# EAGLE schematic Tri-color LED Breakout-v13 (EAGLE 6.3)
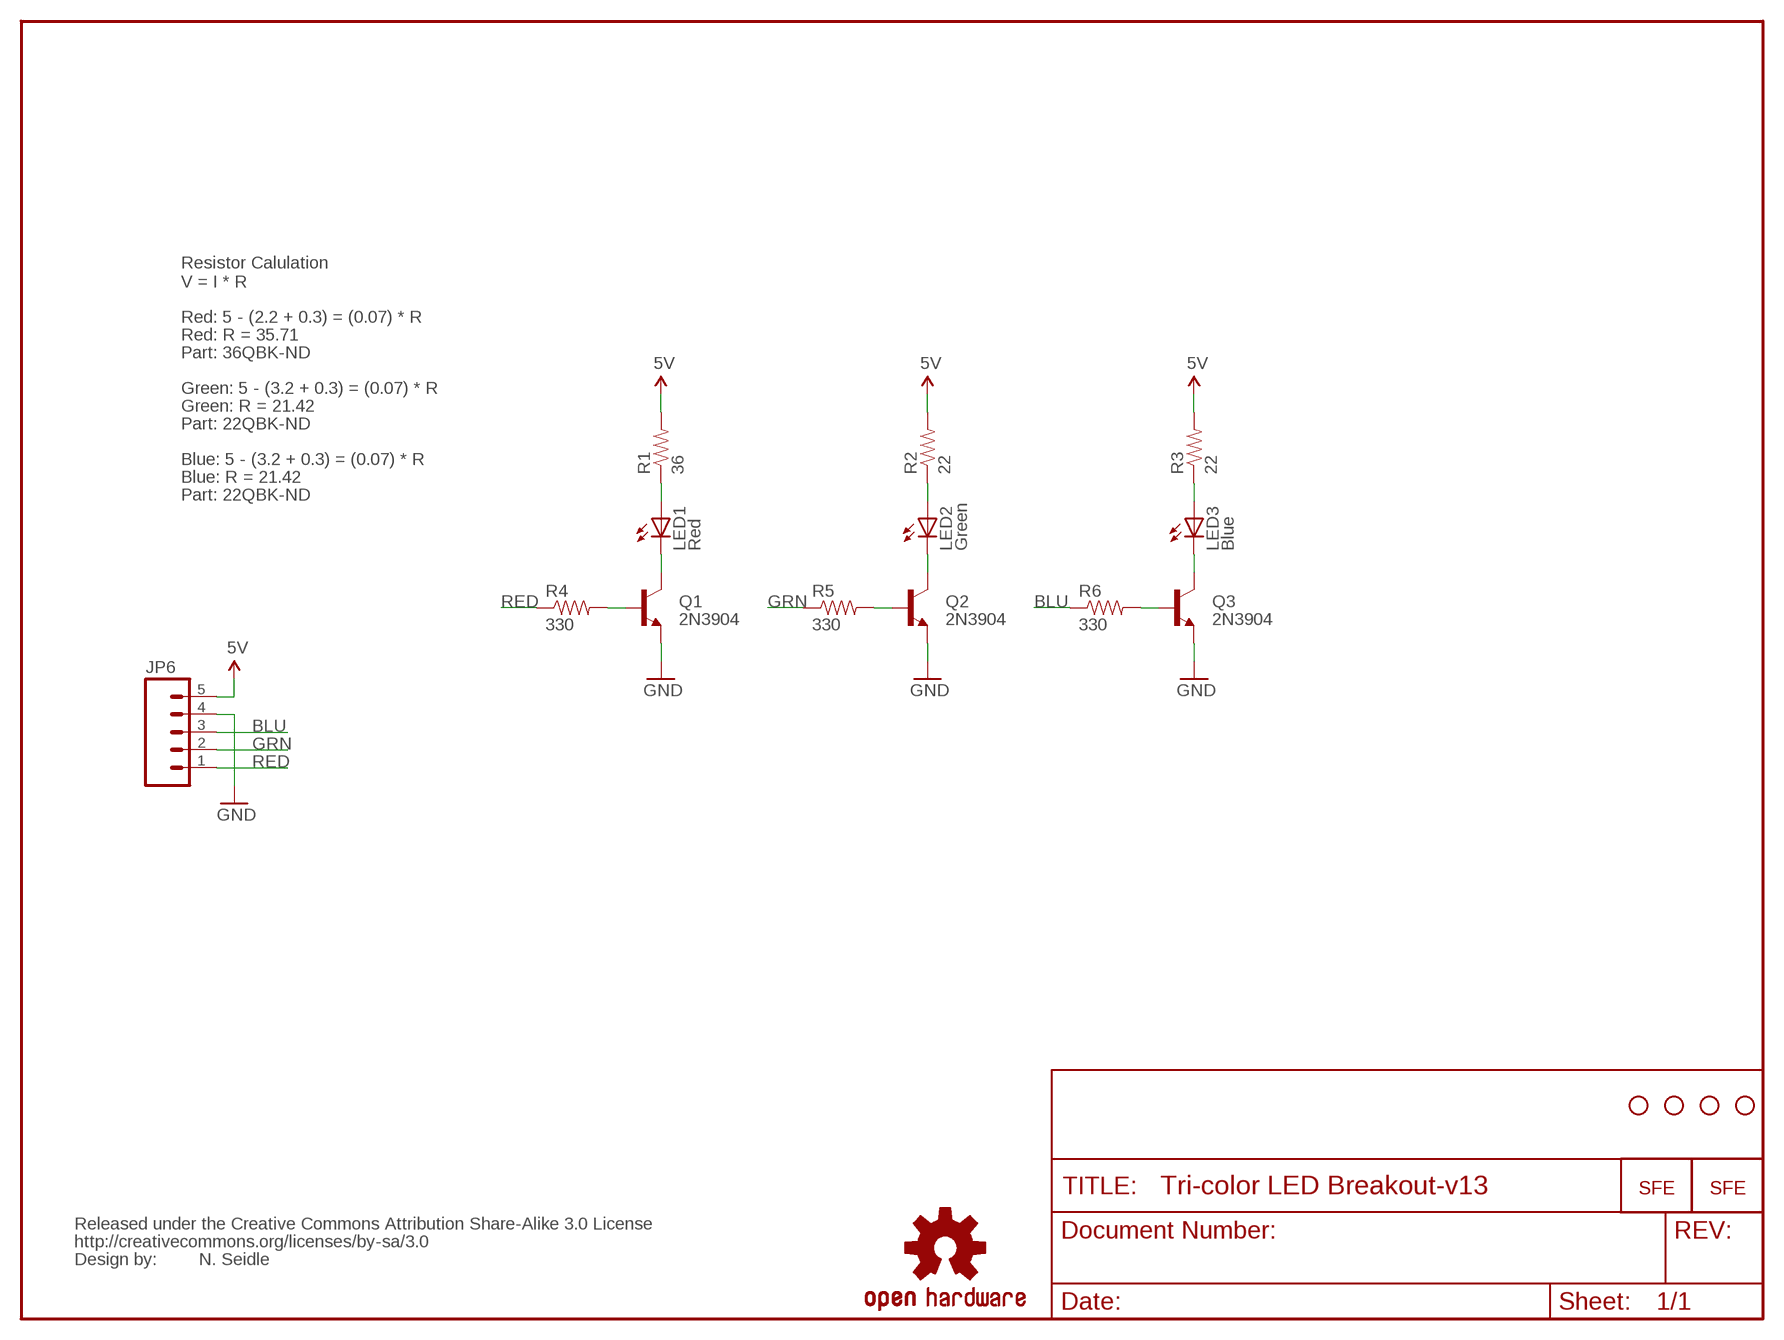
[diagram p0: schematic, sheet 1]

## Parts
JP1  STAND-OFF  [STAND-OFF]
JP2  STAND-OFF  [STAND-OFF]
JP3  STAND-OFF  [STAND-OFF]
JP4  STAND-OFF  [STAND-OFF]
JP5  LOGO-SFESK  [SFE-LOGO-FLAME]
JP6  M05PTH  [1X05]
JP7  LOGO-SFESK  [SFE-LOGO-FLAME]
LED1  Red  LED10MM  [LED10MM]
LED2  Green  LED10MM  [LED10MM]
LED3  Blue  LED10MM  [LED10MM]
Q1  2N3904  TRANSISTOR_NPNTO92  [TO-92]
Q2  2N3904  TRANSISTOR_NPNTO92  [TO-92]
Q3  2N3904  TRANSISTOR_NPNTO92  [TO-92]
R1  36  RESISTORPTH-1/4W  [AXIAL-0.4]
R2  22  RESISTORPTH-1/4W  [AXIAL-0.4]
R3  22  RESISTORPTH-1/4W  [AXIAL-0.4]
R4  330  RESISTORAXIAL-0.3  [AXIAL-0.3]
R5  330  RESISTORAXIAL-0.3  [AXIAL-0.3]
R6  330  RESISTORAXIAL-0.3  [AXIAL-0.3]
U$1  CREATIVE_COMMONS  [CREATIVE_COMMONS]
U$6  OSHW-LOGOS  [OSHW-LOGO-S]

## Nets
5V: JP6.5 R1.P$2 R2.P$2 R3.P$2
BLU: JP6.3 R6.P$1
GND: JP6.4 Q1.1(E) Q2.1(E) Q3.1(E)
GRN: JP6.2 R5.P$1
N$1: LED2.A R2.P$1
N$2: LED3.A R3.P$1
N$3: LED1.A R1.P$1
N$4: LED1.C Q1.3(C)
N$5: LED2.C Q2.3(C)
N$6: LED3.C Q3.3(C)
N$7: Q1.2(B) R4.P$2
N$8: Q2.2(B) R5.P$2
N$9: Q3.2(B) R6.P$2
RED: JP6.1 R4.P$1

## Notes on the sheet
- Resistor Calulation
  V = I * R
- Red: 5 - (2.2 + 0.3) = (0.07) * R
- Red: R = 35.71
- Part: 36QBK-ND
- Green: 5 - (3.2 + 0.3) = (0.07) * R
- Green: R = 21.42
- Part: 22QBK-ND
- Blue: 5 - (3.2 + 0.3) = (0.07) * R
- Blue: R = 21.42
- Part: 22QBK-ND
- N. Seidle

## Library data of the parts
JP1-JP4 = SparkFun:STAND-OFF: Stand Off This is the mechanical footprint for a #4 phillips button head screw. Use the keepout ring to avoid running the screw head into surrounding components. SKU : PRT-00447
JP5 JP7 = SparkFun:LOGO-SFE: Spark Fun Electronics PCB Logo This is the standard Spark Fun Electronics PCB logo.
JP6 = SparkFun:M05: Header 5 Standard 5-pin 0.1" header. Use with straight break away headers (SKU : PRT-00116), right angle break away headers (PRT-00553), swiss pins (PRT-00743), machine pins (PRT-00117), and female headers (PRT-00115). Molex polarized connector foot print use with SKU : PRT-08230 with associated crimp pins and housings.
LED1-LED3 = SparkFun:LED: LEDs Standard schematic elements and footprints for 5mm, 3mm, 1206, and 0603 sized LEDs. 5mm - Spark Fun Electronics SKU : COM-00529 (and others)
Q1-Q3 = SparkFun:TRANSISTOR_NPN: Transistor NPN BJT configuration in SOT23 package. MMBT2222 is the common NPN we use. Double check BCE configuration again layout.
R1-R6 = SparkFun:RESISTOR: Resistor Basic schematic elements and footprints for 0603, 1206, and PTH resistors.
U$1 = SparkFun:CREATIVE_COMMONS
U$6 = SparkFun-Aesthetics:OSHW-LOGO: Open Source Hardware Logo This logo indicates the piece of hardware it is found on incorporates a OSHW license and/or adheres to the definition of open source hardware found here: http://freedomdefined.org/OSHW